# Altium schematic sheet H22R2x_Frontend 1.SchDoc
size Letter; CompanyName: Hexabitz; DocumentNumber: 2; SheetNumber: 2; SheetTotal: 3
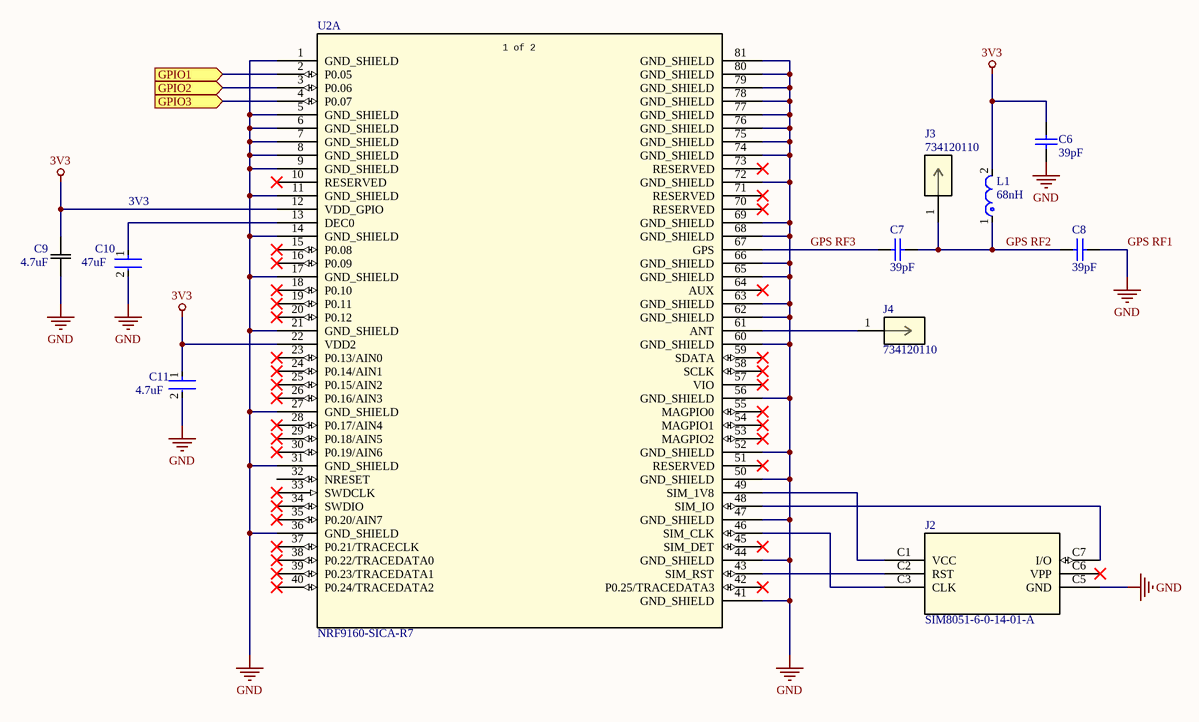
[diagram p0: H22R2x_Frontend 1.SchDoc]

## Parts
C6  39pF  [CAPC1005X56X25ML10T15]
C7  39pF  [CAPC1005X56X25ML10T15]
C8  39pF  [CAPC1005X56X25ML10T15]
C9  4.7uF  [CAP_CL10_SAM]
C10  47uF  [FP-GRM21B-0_2-e0_2_0_7-IPC_B]
C11  4.7uF  [FP-0603-L_1_6_0_15-W_0_8-MFG]
J2  SIM8051-6-0-14-01-A  [SIM8051-6-0-14-01-A_GCT]
J3  734120110  [CONN_73412-0110_MOL]
J4  734120110  [CONN_73412-0110_MOL]
L1  68nH  [FP-LQG18HH_00-MFG]
U2  NRF9160-SICA-R7  [LGA127_16p00X10p50_nRF9160_NOR]  (part A of 2)

## Ports
GPIO1 (in), GPIO2 (in), GPIO3 (in)

## Nets
3V3: C6.2 C9.2 C11.1 L1.2 U2.12(VDD_GPIO) U2.22(VDD2)
GPS RF1: C6.1 C8.2 C9.1 C10.2 C11.2 J2.C5(GND) U2.1(GND_SHIELD) U2.5(GND_SHIELD) U2.6(GND_SHIELD) U2.7(GND_SHIELD) U2.8(GND_SHIELD) U2.9(GND_SHIELD) U2.11(GND_SHIELD) U2.14(GND_SHIELD) U2.17(GND_SHIELD) U2.21(GND_SHIELD) U2.27(GND_SHIELD) U2.31(GND_SHIELD) U2.36(GND_SHIELD) U2.41(GND_SHIELD) U2.44(GND_SHIELD) U2.47(GND_SHIELD) U2.50(GND_SHIELD) U2.52(GND_SHIELD) U2.56(GND_SHIELD) U2.60(GND_SHIELD) U2.62(GND_SHIELD) U2.63(GND_SHIELD) U2.65(GND_SHIELD) U2.66(GND_SHIELD) U2.68(GND_SHIELD) U2.69(GND_SHIELD) U2.72(GND_SHIELD) U2.74(GND_SHIELD) U2.75(GND_SHIELD) U2.76(GND_SHIELD) U2.77(GND_SHIELD) U2.78(GND_SHIELD) U2.79(GND_SHIELD) U2.80(GND_SHIELD) U2.81(GND_SHIELD)  [also labelled GND]
GPIO1: U2.2(P0.05) ; port GPIO1
GPIO2: U2.3(P0.06) ; port GPIO2
GPIO3: U2.4(P0.07) ; port GPIO3
GPS RF2: C7.2 C8.1 J3.1 L1.1
GPS RF3: C7.1 U2.67(GPS)
NetC10_1: C10.1 U2.13(DEC0)
NetJ2_C1: J2.C1(VCC) U2.49(SIM_1V8)
NetJ2_C2: J2.C2(RST) U2.43(SIM_RST)
NetJ2_C3: J2.C3(CLK) U2.46(SIM_CLK)
NetJ2_C7: J2.C7(I/O) U2.48(SIM_IO)
NetJ4_1: J4.1 U2.61(ANT)

Not connected (* = marked no-connect by the designer): J2 C6(VPP)*; U2 10(RESERVED)* 15(P0.08)* 16(P0.09)* 18(P0.10)* 19(P0.11)* 20(P0.12)* 23(P0.13/AIN0)* 24(P0.14/AIN1)* 25(P0.15/AIN2)* 26(P0.16/AIN3)* 28(P0.17/AIN4)* 29(P0.18/AIN5)* 30(P0.19/AIN6)* 32(NRESET) 33(SWDCLK)* 34(SWDIO)* 35(P0.20/AIN7)* 37(P0.21/TRACECLK)* 38(P0.22/TRACEDATA0)* 39(P0.23/TRACEDATA1)* 40(P0.24/TRACEDATA2)* 42(P0.25/TRACEDATA3)* 45(SIM_DET)* 51(RESERVED)* 53(MAGPIO2)* 54(MAGPIO1)* 55(MAGPIO0)* 57(VIO)* 58(SCLK)* 59(SDATA)* 64(AUX)* 70(RESERVED)* 71(RESERVED)* 73(RESERVED)*

## Notes on the sheet
- 3V3
- Module:
- Title:
- Description:
- Size:
- Revision:
- Letter
- www.hexabitz.com
- Date:
- Time:
- Sheet
- of
- (in symbol CMP-006-000000-1, part A) 1 of 2

## Library data of the parts
C6-C8 = CMP-2008-02498-1: 04023A390KAT2A; Manufacturer: AVX Interconnect / Elco; Part Number: 04023A390KAT2A
C9 = CMP-001-00083-2: 4.7 µF ±10% 6.3V Ceramic Capacitor X5R 0603 (1608 Metric); Manufacturer_Name: Samsung; ComponentLink1Description: Digikey Link; Manufacturer_Part_Number: CL10A475KQ8NNNC; Copyright: Copyright (C) 2025 Ultra Librarian. All rights reserved.; Source: CL10A475KQ8NNNC.SchLib; ComponentLink1URL: https://www.digikey.com/en/products/detail/samsung-electro-mechanics/CL10A475KQ8NNNC/3886703; Capacitor Type: Ceramic; Design Item ID: CL10A475KQ8NNNC
C10 = CMP-06035-028650-1: Chip Multilayer Ceramic Capacitors for General Purpose, 0805, 47uF, X5R, 15%, 20%, 6.3V; Tolerance: 20%; Case/Package: 0805; Length: 2mm; Thickness: 1.25mm; Dielectric: X5R; Width: 1.25mm; Capacitance: 47uF; Voltage Rating (DC): 6.3V
C11 = CMP-14477-003024-3: Ceramic Capacitor General Use 4.7uF ±10% 10V X6S 0603; NexarPartId: 75346097; Capacitance: 4.7µF; Material: Ceramic; Voltage Rating (DC): 10V; Case/Package: 0603; Height: 950µm; Max Operating Temperature: 105°C; RoHS: Non-Compliant; Tolerance: 10%; Min Operating Temperature: -55°C; Voltage Rating: 10V
J2 = CMP-022-000000-1: Description; Manufacturer_Name: Global Connector Technology; Design Item ID: SIM8051-6-0-14-01-A; Type: Type; RefDes: RefDes; Source: SIM8051-6-0-14-01-A.SchLib; Copyright: Copyright (C) 2025 Ultra Librarian. All rights reserved.; Manufacturer_Part_Number: SIM8051-6-0-14-01-A
J3 J4 = CMP-002-00091-1: MCRF Jack, Straight, PCB Receptacle, Surface Mount, 1.25mm Mounted Height, 50 Ohms; Manufacturer_Name: Molex Connector Corporation; Design Item ID: 734120110; Copyright: Copyright (C) 2025 Ultra Librarian. All rights reserved.; Source: 734120110.SchLib; Type: Type; Manufacturer_Part_Number: 734120110; RefDes: RefDes
L1 = CMP-06042-006563-1: Multilayer type RF Inductor 68nH ±5% 0.8Ω 400mA 0603 / LQG18HN68NJ00D; Core Material: Air; DC Current: 300mA; Q Factor: 12; Test Frequency: 100MHz; DC Resistance (DCR): 800mR; Shielding: Unshielded; Self Resonant Frequency: 1GHz; Termination: SMD/SMT; Mount: Surface Mount; Case Code (Imperial): 0603; Height: 0.031inch; Tolerance: 5%; Inductance Tolerance: 5%; Package Quantity: 4000; Width: 0.8mm; Length: 0.063inch; Inductance: 68nH; Depth: 0.95mm; Case Code (Metric): 1608; Max DC Current: 300mA; Case/Package: 0603; Military Standard: Not; Min Operating Temperature: -55°C; REACH SVHC: No SVHC; Number of Pins: 2; Max Operating Temperature: 85°C; Lead Free: Lead Free; Current Rating: 300mA; Radiation Hardening: No; Packaging: Tape and Reel
U2 = CMP-006-000000-1: Description; Manufacturer_Name: Nordic Semiconductor; Type: RF; Manufacturer_Part_Number: NRF9160-SICA-R7; RefDes: RefDes; Design Item ID: NRF9160-SICA-R7; Source: NRF9160-SICA-R7.SchLib; Copyright: Copyright (C) 2025 Ultra Librarian. All rights reserved.